# EAGLE schematic Glareshield-revA (EAGLE 7.3.0)
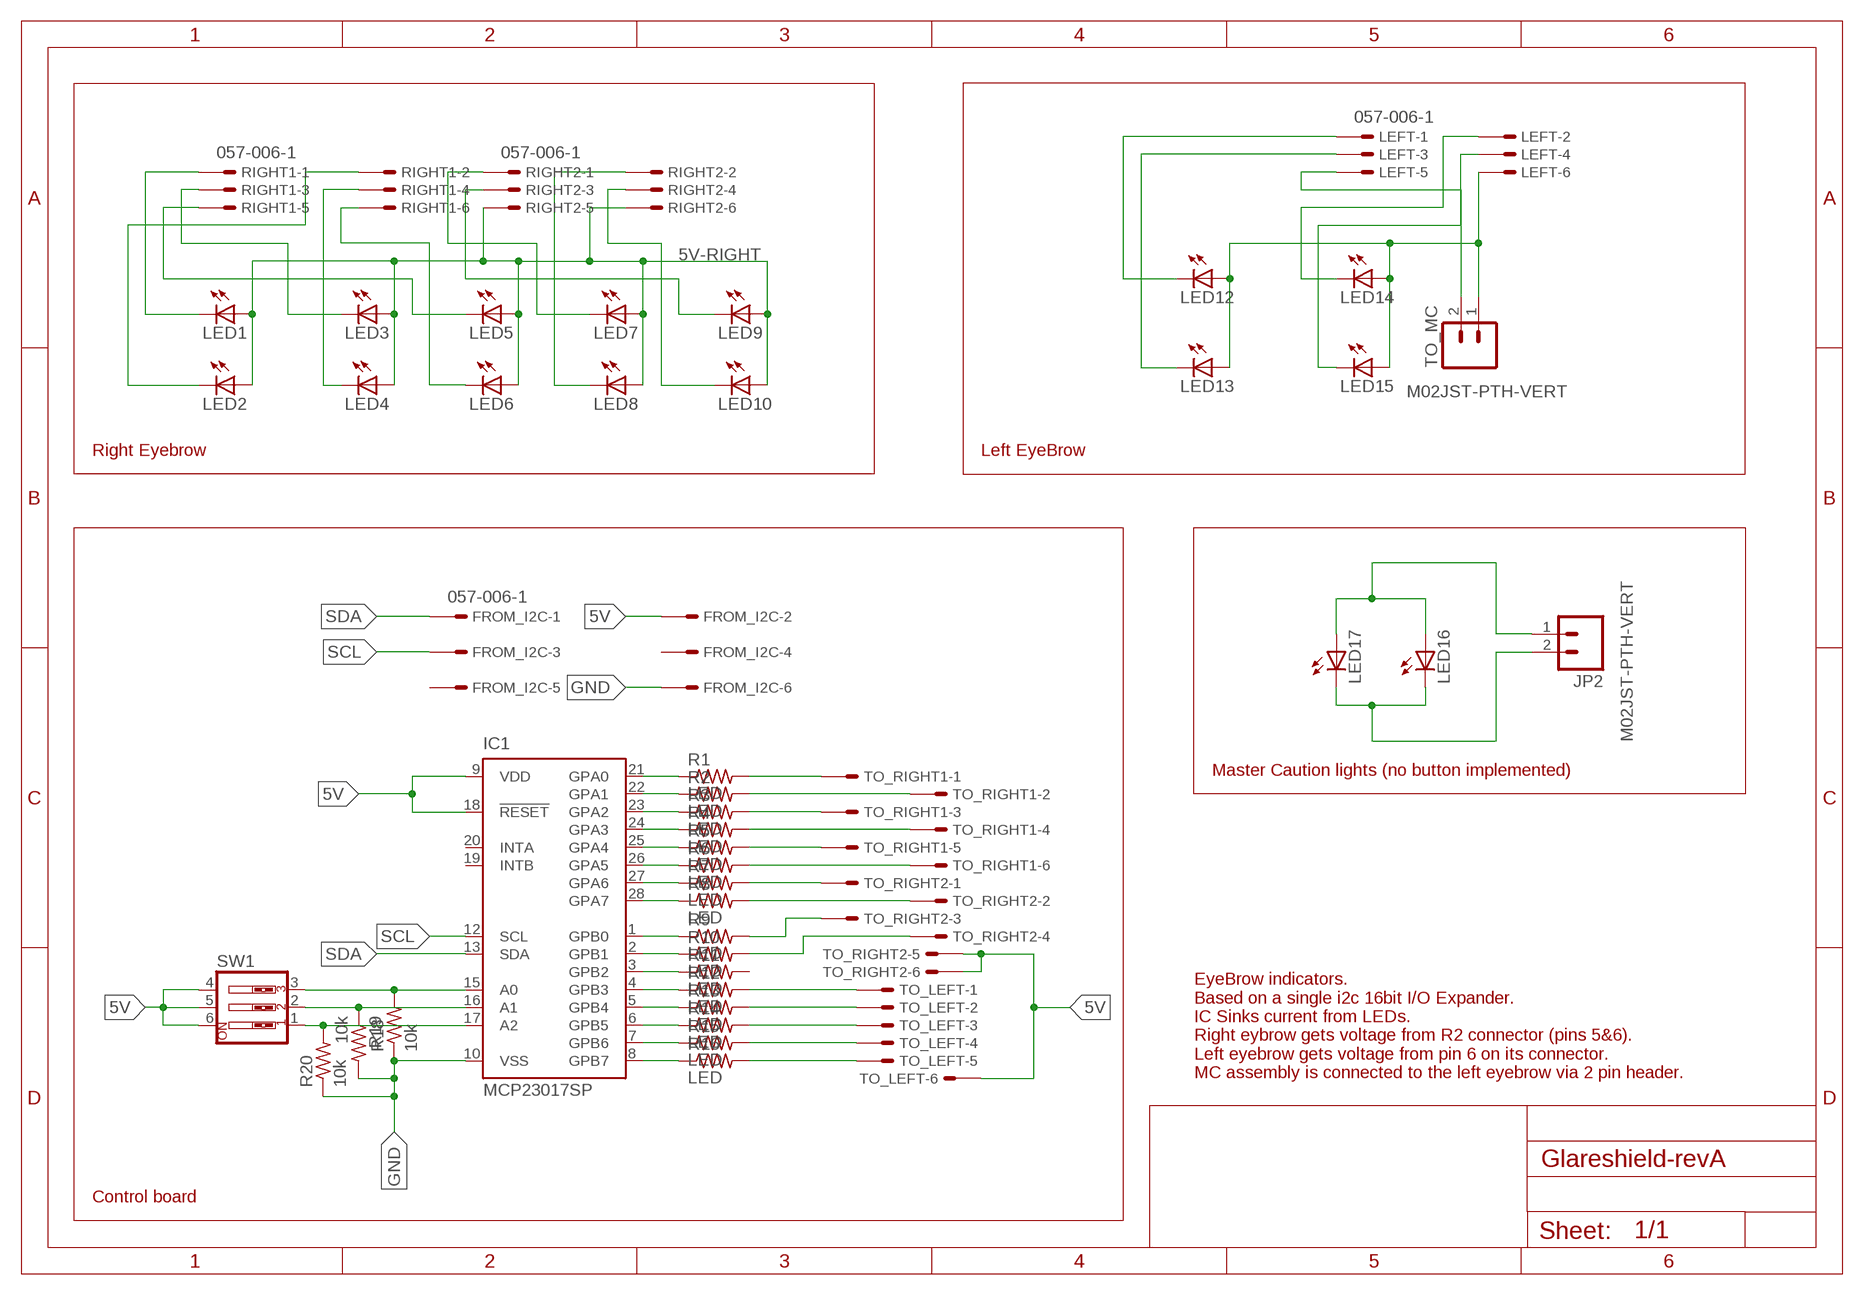
[diagram p0: schematic, sheet 1]

## Parts
FROM_I2C  057-006-1  [057-006-1]
IC1  MCP23017SP  [DIL28-3]
JP2  M02JST-PTH-VERT  [JST-2-PTH-VERT]
LED1  LED3MM  [LED3MM]
LED2  LED3MM  [LED3MM]
LED3  LED3MM  [LED3MM]
LED4  LED3MM  [LED3MM]
LED5  LED3MM  [LED3MM]
LED6  LED3MM  [LED3MM]
LED7  LED3MM  [LED3MM]
LED8  LED3MM  [LED3MM]
LED9  LED3MM  [LED3MM]
LED10  LED3MM  [LED3MM]
LED12  LED3MM  [LED3MM]
LED13  LED3MM  [LED3MM]
LED14  LED3MM  [LED3MM]
LED15  LED3MM  [LED3MM]
LED16  LED3MM  [LED3MM]
LED17  LED3MM  [LED3MM]
LEFT  057-006-1  [057-006-1]
R1  LED  R-US_0204/7  [0204/7]
R2  LED  R-US_0204/7  [0204/7]
R3  LED  R-US_0204/7  [0204/7]
R4  LED  R-US_0204/7  [0204/7]
R5  LED  R-US_0204/7  [0204/7]
R6  LED  R-US_0204/7  [0204/7]
R7  LED  R-US_0204/7  [0204/7]
R8  LED  R-US_0204/7  [0204/7]
R9  LED  R-US_0204/7  [0204/7]
R10  LED  R-US_0204/7  [0204/7]
R11  LED  R-US_0204/7  [0204/7]
R12  LED  R-US_0204/7  [0204/7]
R13  LED  R-US_0204/7  [0204/7]
R14  LED  R-US_0204/7  [0204/7]
R15  LED  R-US_0204/7  [0204/7]
R16  LED  R-US_0204/7  [0204/7]
R18  10k  R-US_0204/7  [0204/7]
R19  10k  R-US_0204/7  [0204/7]
R20  10k  R-US_0204/7  [0204/7]
RIGHT1  057-006-1  [057-006-1]
RIGHT2  057-006-1  [057-006-1]
SW1  SW_DIP-3  [EDG-03]
TO_LEFT  057-006-1  [057-006-1]
TO_MC  M02JST-PTH-VERT  [JST-2-PTH-VERT]
TO_RIGHT1  057-006-1  [057-006-1]
TO_RIGHT2  057-006-1  [057-006-1]

## Nets
5V [power]: FROM_I2C.2 IC1.9(VDD) IC1.18(!RESET) SW1.4 SW1.5 SW1.6 TO_LEFT.6 TO_RIGHT2.5 TO_RIGHT2.6
5V-LEFT [power]: LED12.A LED13.A LED14.A LED15.A LEFT.6 TO_MC.1
5V-RIGHT [power]: LED1.A LED2.A LED3.A LED4.A LED5.A LED6.A LED7.A LED8.A LED9.A LED10.A RIGHT2.5 RIGHT2.6
GND [power]: FROM_I2C.6 IC1.10(VSS) R18.1 R19.2 R20.1
N$1: IC1.24(GPA3) R4.1
N$2: IC1.21(GPA0) R1.1
N$3: IC1.22(GPA1) R2.1
N$4: IC1.23(GPA2) R3.1
N$5: IC1.25(GPA4) R5.1
N$6: IC1.26(GPA5) R6.1
N$7: IC1.27(GPA6) R7.1
N$8: IC1.28(GPA7) R8.1
N$9: IC1.1(GPB0) R9.1
N$10: IC1.2(GPB1) R10.1
N$11: IC1.3(GPB2) R11.1
N$12: IC1.4(GPB3) R12.1
N$13: IC1.5(GPB4) R13.1
N$14: IC1.6(GPB5) R14.1
N$15: IC1.7(GPB6) R15.1
N$16: IC1.8(GPB7) R16.1
N$17: LED1.K(C) RIGHT1.1
N$18: LED3.K(C) RIGHT1.3
N$19: LED5.K(C) RIGHT1.5
N$20: LED6.K(C) RIGHT1.6
N$21: LED4.K(C) RIGHT1.4
N$22: LED2.K(C) RIGHT1.2
N$23: LED7.K(C) RIGHT2.1
N$24: R12.2 TO_LEFT.1
N$25: LED9.K(C) RIGHT2.3
N$26: LED8.K(C) RIGHT2.2
N$27: LED10.K(C) RIGHT2.4
N$28: R1.2 TO_RIGHT1.1
N$29: R2.2 TO_RIGHT1.2
N$30: R3.2 TO_RIGHT1.3
N$31: R4.2 TO_RIGHT1.4
N$32: R5.2 TO_RIGHT1.5
N$33: R6.2 TO_RIGHT1.6
N$34: R7.2 TO_RIGHT2.1
N$35: R8.2 TO_RIGHT2.2
N$36: R10.2 TO_RIGHT2.4
N$37: R9.2 TO_RIGHT2.3
N$38: IC1.17(A2) R20.2 SW1.1
N$39: IC1.16(A1) R19.1 SW1.2
N$40: IC1.15(A0) R18.2 SW1.3
N$41: LED12.K(C) LEFT.1
N$42: R13.2 TO_LEFT.2
N$43: R14.2 TO_LEFT.3
N$44: R15.2 TO_LEFT.4
N$45: R16.2 TO_LEFT.5
N$46: LEFT.5 TO_MC.2
N$47: LED13.K(C) LEFT.3
N$48: LED14.K(C) LEFT.2
N$49: LED15.K(C) LEFT.4
N$51 [power]: JP2.1 LED16.A LED17.A
N$52: JP2.2 LED16.K(C) LED17.K(C)
SCL: FROM_I2C.3 IC1.12(SCL)
SDA: FROM_I2C.1 IC1.13(SDA)
Unconnected: FROM_I2C.4 FROM_I2C.5 IC1.19(INTB) IC1.20(INTA) R11.2

## Notes on the sheet
- Right Eyebrow | Left EyeBrow
- Master Caution lights (no button implemented)
- EyeBrow indicators.
  Based on a single i2c 16bit I/O Expander.
  IC Sinks current from LEDs.
  Right eybrow gets voltage from R2 connector (pins 5&6).
  Left eyebrow gets voltage from pin 6 on its connector.
  MC assembly is connected to the left eyebrow via 2 pin header.
- Control board

## Library data of the parts
FROM_I2C LEFT RIGHT1 RIGHT2 TO_LEFT TO_RIGHT1 TO_RIGHT2 = con-panduit:057-006-: CONNECTOR 6-pin series 057 contact pc board low profile headers; OC_FARNELL: unknown; OC_NEWARK: unknown
IC1 = microchip:MCP23017: http://ww1.microchip.com/downloads/en/DeviceDoc/21952a.pdf Source: http://ww1.microchip.com/downloads/en/DeviceDoc/21952a.pdf; MF: MICROCHIP; MPN: MCP23017-E/SP; OC_FARNELL: 1332088; OC_NEWARK: 31K2959
JP2 TO_MC = SparkFun-Connectors:M02: Standard 2-pin 0.1" header. Use with - straight break away headers ( PRT-00116) - right angle break away headers (PRT-00553) - swiss pins (PRT-00743) - machine pins (PRT-00117) - female headers (PRT-00115) Molex polarized connector foot print use with: PRT-08233 with associated crimp pins and housings. 2.54_SCREWTERM for use with PRT-10571. 3.5mm Screw Terminal footprints for PRT-08084 5mm Screw Terminal footprints for use with PRT-08432
LED1-LED10 LED12-LED17 = adafruit:LED: LED OSRAM: - CHIPLED LG R971, LG N971, LY N971, LG Q971, LY Q971, LO R971, LY R971 LH N974, LH R974 LS Q976, LO Q976, LY Q976 LO Q996 - Hyper CHIPLED LW Q18S LB Q993, LB Q99A, LB R99A - SideLED LS A670, LO A670, LY A670, LG A670, LP A670 LB A673, LV A673, LT A673, LW A673 LH A674 LY A675 LS A676, LA A676, LO A676, LY A676, LW A676 LS A679, LY A679, LG A679 - Hyper Micro SIDELED® LS Y876, LA Y876, LO Y876, LY Y876 LT Y87S - SmartLED LW L88C, LW L88S LB L89C, LB L89S, LG L890 LS L89K, LO L89K, LY L89K LS L896, LA L896, LO L896, LY L896 - TOPLED LS T670, LO T670, LY T670, LG T670, LP T670 LSG T670, LSP T670, LSY T670, LOP T670, LYG T670 LG T671, LOG T671, LSG T671 LB T673, LV T673, LT T673, LW T673 LH T674 LS T676, LA T676, LO T676, LY T676, LB T676, LH T676, LSB T676, LW T676 LB T67C, LV T67C, LT T67C, LS T67K, LO T67K, LY T67K, LW E67C LS E67B, LA E67B, LO E67B, LY E67B, LB E67C, LV E67C, LT E67C LW T67C LS T679, LY T679, LG T679 LS T770, LO T770, LY T770, LG T770, LP T770 LB T773, LV T773, LT T773, LW T773 LH T774 LS E675, LA E675, LY E675, LS T675 LS T776, LA T776, LO T776, LY T776, LB T776 LHGB T686 LT T68C, LB T68C - Hyper Mini TOPLED® LB M676 - Mini TOPLED Santana® LG M470 LS M47K, LO M47K, LY M47K Source: http://www.osram.convergy.de/
R1-R16 R18-R20 = adafruit:R-US_: RESISTOR, American symbol
SW1 = special:SW_DIP-3: DIP SWITCH

## Net classes
0 default: width 0.254 mm, drill 0.254 mm, clearance 0.254 mm
1 power: width 0.406 mm, drill 0.406 mm, clearance 0.406 mm